# Altium schematic sheet Main.SchDoc: =DocumentName
size A4; CompanyName: "AS Manufacturing" LLC; Organization: "AS Manufacturing" LLC; Address1: 5 Sklyarenka St.; Address2: Kyiv 04073; Address3: Ukraine; Address4: https://ajax.systems/en/; SheetNumber: 1; SheetTotal: 11; Template_version: 1.0.1
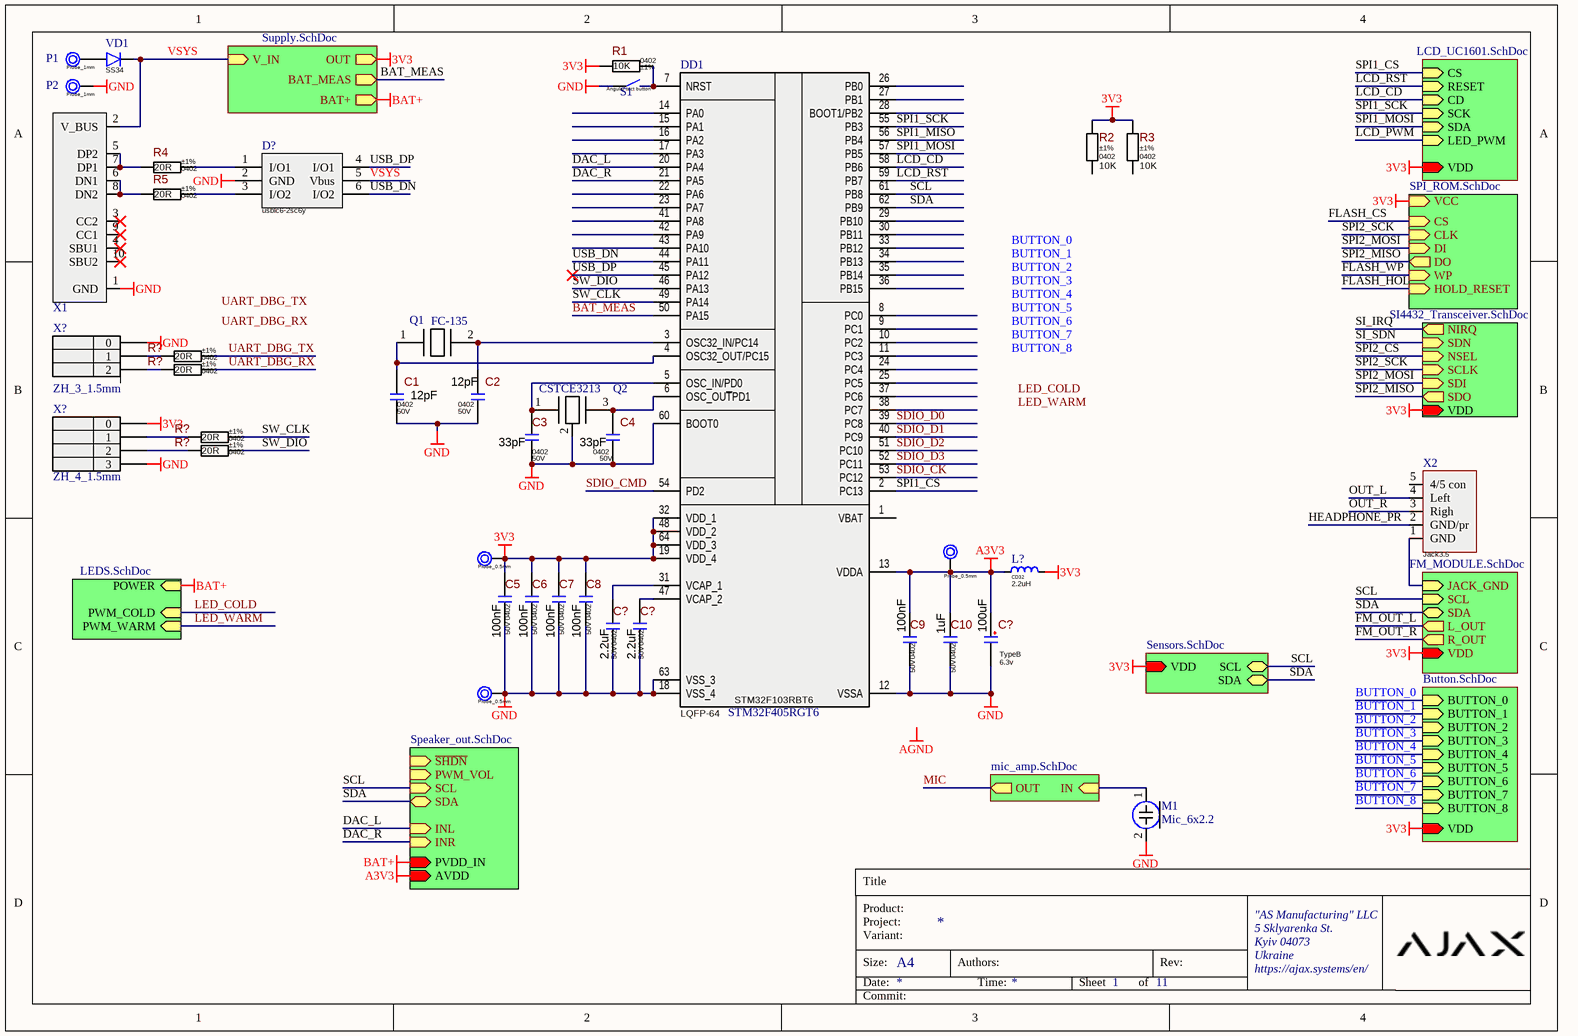
[diagram p0: Main.SchDoc]

## Parts
(Parts that share a designator on the sheet are numbered #1, #2 ... from top to bottom, then left to right.)
C1  Package: 0402  Voltage: 50V  [Cap_0402]  (hidden comment: 12pF)
C2  Package: 0402  Voltage: 50V  [Cap_0402]  (hidden comment: 12pF)
C3  Package: 0402  Voltage: 50V  [Cap_0402]  (hidden comment: 33pF)
C4  Package: 0402  Voltage: 50V  [Cap_0402]  (hidden comment: 33pF)
C5  Package: 0402  Voltage: 50V  [Cap_0402]  (hidden comment: 100nF)
C6  Package: 0402  Voltage: 50V  [Cap_0402]  (hidden comment: 100nF)
C7  Package: 0402  Voltage: 50V  [Cap_0402]  (hidden comment: 100nF)
C8  Package: 0402  Voltage: 50V  [Cap_0402]  (hidden comment: 100nF)
C9  Package: 0402  Voltage: 50V  [Cap_0402]  (hidden comment: 100nF)
C10  Package: 0402  Voltage: 50V  [Cap_0402]  (hidden comment: 1uF)
C?#1  Package: 0402  Voltage: 50V  [Cap_0402]  (hidden comment: 2.2uF)
C?#2  Package: 0402  Voltage: 50V  [Cap_0402]  (hidden comment: 2.2uF)
C?#3  Package: TypeB  Voltage: 6.3v  [Tantalum TYPE-B]  (hidden comment: 100uF)
D?  usblc6-2sc6y  [SOT23-6]
DD1  STM32F405RGT6  Name: STM32F103RBT6  [LQFP-64]
L?  value 2.2uH  [CD32]  (hidden comment: CD32)
M1  Mic_6x2.2  [Electret mic 6x2.2]
P1  Probe_1mm  [Probe_1mm]
P2  Probe_1mm  [Probe_1mm]
P15  Probe_0.5mm  [Probe_0.5mm]
P16  Probe_0.5mm  [Probe_0.5mm]
P17  Probe_0.5mm  [Probe_0.5mm]
Q1  FC-135  [Quarz FC-135]
Q2  CSTCE3213  [Quartz MEMS CSTCE]
R1  value 10K  Tolerance: ±1%  Package: 0402  [Res_0402]  (hidden comment: Res_0402_10K)
R2  value 10K  Tolerance: ±1%  Package: 0402  [Res_0402]  (hidden comment: Res_0402_10K)
R3  value 10K  Tolerance: ±1%  Package: 0402  [Res_0402]  (hidden comment: Res_0402_10K)
R4  value 20R  Tolerance: ±1%  Package: 0402  [Res_0402]  (hidden comment: Res_0402_20R)
R5  value 20R  Tolerance: ±1%  Package: 0402  [Res_0402]  (hidden comment: Res_0402_20R)
R?#1  value 20R  Tolerance: ±1%  Package: 0402  [Res_0402]  (hidden comment: Res_0402_20R)
R?#2  value 20R  Tolerance: ±1%  Package: 0402  [Res_0402]  (hidden comment: Res_0402_20R)
R?#3  value 20R  Tolerance: ±1%  Package: 0402  [Res_0402]  (hidden comment: Res_0402_20R)
R?#4  value 20R  Tolerance: ±1%  Package: 0402  [Res_0402]  (hidden comment: Res_0402_20R)
S1  Angular tact button  [Tact_button_3X6X3.5mm]
VD1  SS34  [DO-214AA]
X1  Type-c  [Type-c_0.8]  (value not drawn)
X2  Name: Jack3.5  [Jack3.5_male]  (hidden comment: Jack3.5_male)
X?#1  ZH_3_1.5mm  [ZH_3_1.5mm]
X?#2  ZH_4_1.5mm  [ZH_4_1.5mm]

## Sub-sheets
Designator = LCD_UC1601.SchDoc: CS (in), RESET (in), CD (in), SCK (in), SDA (in), LED_PWM (in), VDD (in)
Designator = Speaker_out.SchDoc: ~{SHDN} (in), PWM_VOL (in), SCL (in), SDA (bidir), INL (in), INR (in), PVDD_IN (in), AVDD (in)
Designator = Supply.SchDoc: OUT (out), V_IN (in), BAT_MEAS (out), BAT+ (out)
Designator = SI4432_Transceiver.SchDoc: NIRQ (out), SDN (in), NSEL (in), SCLK (in), SDI (in), SDO (out), VDD (in)
Designator = FM_MODULE.SchDoc: SCL (in), SDA (bidir), L_OUT (out), R_OUT (out), VDD (in), JACK_GND (in)
Designator = Button.SchDoc: BUTTON_0 (in), VDD (in), BUTTON_1 (in), BUTTON_2 (in), BUTTON_3 (in), BUTTON_4 (in), BUTTON_5 (in), BUTTON_6 (in), BUTTON_7 (in), BUTTON_8 (in)
Designator = LEDS.SchDoc: POWER (in), PWM_COLD (in), PWM_WARM (in)
Designator = SPI_ROM.SchDoc: VCC (in), CS (in), CLK (in), DI (in), DO (out), WP (in), HOLD_RESET (in)
Designator = Sensors.SchDoc: VDD (in), SDA (bidir), SCL (bidir)
IN = mic_amp.SchDoc: OUT (out), IN (in)

## Nets
3V3: C5.1 C6.1 C7.1 C8.1 DD1.19(VDD_4) DD1.32(VDD_1) DD1.48(VDD_2) DD1.64(VDD_3) L?.1 P15.1(probe_point) R1.1 R2.1 R3.1 X?#2.0 ; sheet Designator/VDD, sheet Designator/OUT, sheet Designator/VDD, sheet Designator/VDD, sheet Designator/VDD, sheet Designator/VCC, sheet Designator/VDD
A3V3: C9.1 C10.1 C?#3.1 DD1.13(VDDA) L?.2 P16.1(probe_point) ; sheet Designator/AVDD
BAT+: sheet Designator/PVDD_IN, sheet Designator/BAT+, sheet Designator/POWER
GND: C1.2 C2.2 C3.2 C4.2 C5.2 C6.2 C7.2 C8.2 C9.2 C10.2 C?#1.2 C?#2.2 C?#3.2 D?.2(GND) DD1.12(VSSA) DD1.18(VSS_4) DD1.60(BOOT0) DD1.63(VSS_3) M1.2 P2.1(probe_point) P17.1(probe_point) Q2.2 S1.1 X1.1(GND) X?#1.0 X?#2.3
BAT_MEAS: DD1.50(PA15) ; sheet Designator/BAT_MEAS
BUTTON_0: sheet Designator/BUTTON_0
BUTTON_1: sheet Designator/BUTTON_1
BUTTON_2: sheet Designator/BUTTON_2
BUTTON_3: sheet Designator/BUTTON_3
BUTTON_4: sheet Designator/BUTTON_4
BUTTON_5: sheet Designator/BUTTON_5
BUTTON_6: sheet Designator/BUTTON_6
BUTTON_7: sheet Designator/BUTTON_7
BUTTON_8: sheet Designator/BUTTON_8
DAC_L: DD1.20(PA4) ; sheet Designator/INL
DAC_R: DD1.21(PA5) ; sheet Designator/INR
FLASH_CS: sheet Designator/CS
FLASH_HOLD: sheet Designator/HOLD_RESET
FLASH_WP: sheet Designator/WP
FM_OUT_L: sheet Designator/L_OUT
FM_OUT_R: sheet Designator/R_OUT
HEADPHONE_PR: X2.2(GND/pr)
LCD_CD: DD1.58(PB6) ; sheet Designator/CD
LCD_PWM: sheet Designator/LED_PWM
LCD_RST: DD1.59(PB7) ; sheet Designator/RESET
LED_COLD: sheet Designator/PWM_COLD
LED_WARM: sheet Designator/PWM_WARM
MIC: sheet IN/OUT
OUT_L: X2.4(Left)
OUT_R: X2.3(Righ)
SCL: DD1.61(PB8) ; sheet Designator/SCL, sheet Designator/SCL, sheet Designator/SCL
SDA: DD1.62(PB9) ; sheet Designator/SDA, sheet Designator/SDA, sheet Designator/SDA
SDIO_CK: DD1.53(PC12)
SDIO_CMD: DD1.54(PD2)
SDIO_D0: DD1.39(PC8)
SDIO_D1: DD1.40(PC9)
SDIO_D2: DD1.51(PC10)
SDIO_D3: DD1.52(PC11)
SI_IRQ: sheet Designator/NIRQ
SI_SDN: sheet Designator/SDN
SPI1_CS: DD1.2(PC13) ; sheet Designator/CS
SPI1_MISO: DD1.56(PB4)
SPI1_MOSI: DD1.57(PB5) ; sheet Designator/SDA
SPI1_SCK: DD1.55(PB3) ; sheet Designator/SCK
SPI2_CS: sheet Designator/NSEL
SPI2_MISO: sheet Designator/SDO, sheet Designator/DO
SPI2_MOSI: sheet Designator/SDI, sheet Designator/DI
SPI2_SCK: sheet Designator/SCLK, sheet Designator/CLK
SW_CLK: DD1.49(PA14) R?#3.2
SW_DIO: DD1.46(PA13) R?#4.2
UART_DBG_RX: R?#2.2
UART_DBG_TX: R?#1.2
USB_DN: D?.6(I/O2) DD1.44(PA11)
USB_DP: D?.4(I/O1) DD1.45(PA12)
VSYS: D?.5(Vbus) VD1.2(C) X1.2(V_BUS) ; sheet Designator/V_IN
NetC1_1: C1.1 DD1.4(OSC32_OUT/PC15) Q1.1(probe_point)
NetC2_1: C2.1 DD1.3(OSC32_IN/PC14) Q1.2(probe_point)
NetC3_1: C3.1 DD1.5(OSC_IN/PD0) Q2.1(probe_point)
NetC4_1: C4.1 DD1.6(OSC_OU~{T}PD1) Q2.3(probe_point)
NetC?#1_1: C?#1.1 DD1.31(VCAP_1)
NetC?#2_1: C?#2.1 DD1.47(VCAP_2)
NetD?_1: D?.1(I/O1) R4.2
NetD?_3: D?.3(I/O2) R5.2
NetDD1_7: DD1.7(NRST) R1.2 S1.2
NetM1_1: M1.1 ; sheet IN/IN
NetP1_1: P1.1(probe_point) VD1.1(A)
NetR4_1: R4.1 X1.5(DP2) X1.7(DP1)
NetR5_1: R5.1 X1.6(DN1) X1.8(DN2)
NetR?#1_1: R?#1.1 X?#1.1
NetR?#2_1: R?#2.1 X?#1.2
NetR?#3_1: R?#3.1 X?#2.1
NetR?#4_1: R?#4.1 X?#2.2
NetX2_1: X2.1(GND) ; sheet Designator/JACK_GND

Not connected (* = marked no-connect by the designer): DD1 1(VBAT) 8(PC0) 9(PC1) 10(PC2) 11(PC3) 14(PA0) 15(PA1) 16(PA2) 17(PA3) 22(PA6) 23(PA7) 24(PC4) 25(PC5) 26(PB0) 27(PB1) 28(BOOT1/PB2) 29(PB10) 30(PB11) 33(PB12) 34(PB13) 35(PB14) 36(PB15) 37(PC6) 38(PC7) 41(PA8) 42(PA9) 43(PA10); R2 2; R3 2; X1 3(CC2)* 4(SBU1)* 9(CC1)* 10(SBU2)*; X2 5(4/5_con)

## Notes on the sheet
- Labels drawn without touching a wire or pin: AGND, BUTTON_0, BUTTON_1, BUTTON_2, BUTTON_3, BUTTON_4, BUTTON_5, BUTTON_6, BUTTON_7, BUTTON_8, LED_COLD, LED_WARM, UART_DBG_RX, UART_DBG_TX
- Title
- Product:
- Project:
- Size:
- Date:
- Variant:
- A4
- Authors:
- Time:
- Sheet
- of
- Rev:
- Commit:

## Library data of the parts
C1 C2 = Cap_0402_12pF: 12pF 50V  ±25% 0402 Ceramic Capacitor; Component Type: SMD; Tolerance: ±25%; ComponentLink1URL: https://search.murata.co.jp/Ceramy/image/img/A01X/G101/ENG/GRM31CR60J107ME39-01.pdf; ComponentLink1Description: Datasheet; Value: 12pF
C3 C4 = Cap_0402_33pF: 33pF 50V  ±25% 0402 Ceramic Capacitor; Component Type: SMD; Tolerance: ±25%; ComponentLink1URL: https://search.murata.co.jp/Ceramy/image/img/A01X/G101/ENG/GRM31CR60J107ME39-01.pdf; ComponentLink1Description: Datasheet; Value: 33pF
C5-C9 = Cap_0402_100nF: 100nF 50V  ±25% 0402 Ceramic Capacitor; Component Type: SMD; Tolerance: ±25%; ComponentLink1URL: https://search.murata.co.jp/Ceramy/image/img/A01X/G101/ENG/GRM31CR60J107ME39-01.pdf; ComponentLink1Description: Datasheet; Value: 100nF
C10 = Cap_0402_1uF: 1uF 50V  ±25% 0402 Ceramic Capacitor; Component Type: SMD; Tolerance: ±25%; ComponentLink1URL: https://search.murata.co.jp/Ceramy/image/img/A01X/G101/ENG/GRM31CR60J107ME39-01.pdf; ComponentLink1Description: Datasheet; Value: 1uF
C?#1 C?#2 = Cap_0402_2.2uF: 2.2uF 50V  ±25% 0402 Ceramic Capacitor; Component Type: SMD; Tolerance: ±25%; ComponentLink1URL: https://search.murata.co.jp/Ceramy/image/img/A01X/G101/ENG/GRM31CR60J107ME39-01.pdf; ComponentLink1Description: Datasheet; Value: 2.2uF
C?#3 = Cap_TypeB_100uF: Tantalum_TYPE-B 100uF 6.3V; Tolerance: ±25%; ComponentLink1URL: https://search.murata.co.jp/Ceramy/image/img/A01X/G101/ENG/GRM31CR60J107ME39-01.pdf; ComponentLink1Description: Datasheet; Component Type: SMD; Value: 100uF
DD1 = STM32F405RGT6: ARM Cortex-M3 MCU with 1024 kB Flash 192kB ROM, 168 MHz CPU, LQFP-64; Manufacturer: STMicroelectronics; Component Type: SMD; Package: LQFP-64
L? = CD32: 2.2uH; Size: CD32
Q1 = Quarz 32.768kHz: Parameter 1: *
Q2 = CSTCE3213: QUARZ 8MHz; Parameter 1: *
R1-R3 = Res_0402_10K: ±1% 1/16W 0402; Power Rating: 0.062W; Voltage: 50V; ComponentLink1URL: https://www.yageo.com/upload/media/product/productsearch/datasheet/rchip/PYu-RC_Group_51_RoHS_L_10.pdf; ComponentLink1Description: Datasheet
R4 R5 R?#1-R?#4 = Res_0402_20R: ±1% 1/16W 0402; Power Rating: 0.062W; Voltage: 50V; ComponentLink1URL: https://www.yageo.com/upload/media/product/productsearch/datasheet/rchip/PYu-RC_Group_51_RoHS_L_10.pdf; ComponentLink1Description: Datasheet
S1 = Angular tact button: 3X6X3.5mm; Name: Angular tact button
VD1 = SS34: Shotky diode 40v 3A (drop 0.75v 3A); Name: SS34
X1 = USB_Type-c_0.8mm
D? = usblc6-2sc6y: Name: usblc6-2sc6y
P1 P2 = Probe_1mm: Value: Probe_1mm
P15-P17 = Probe_0.5mm: Value: Probe_0.5mm